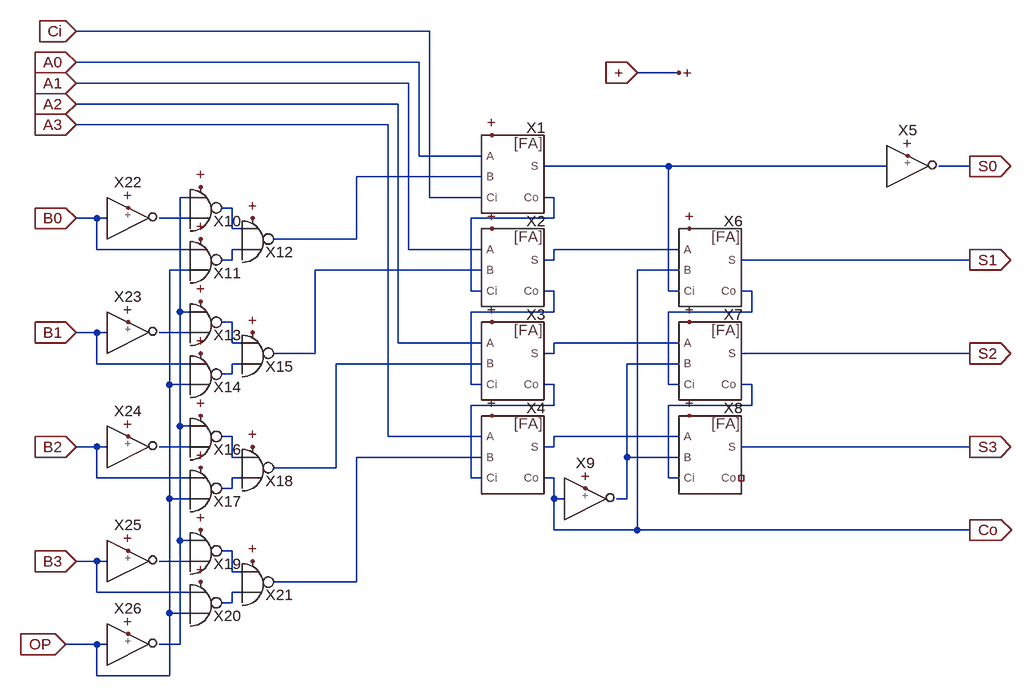
[diagram p0: schematic AddSub.asc]
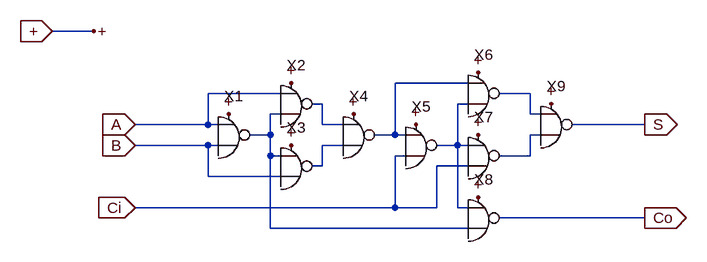
[diagram p1: sub-circuit fa.asc]
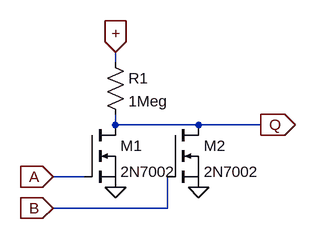
[diagram p2: sub-circuit nor2.asc]
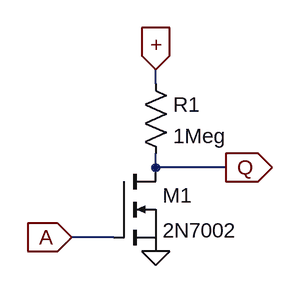
[diagram p3: sub-circuit inv.asc]
AddSub.asc, the LTspice schematic file:
Version 4
SHEET 1 1180 680
WIRE 272 -352 -272 -352
WIRE 256 -304 -272 -304
WIRE 656 -288 592 -288
WIRE 240 -272 -272 -272
WIRE 224 -240 -272 -240
WIRE 208 -208 -272 -208
WIRE 256 -160 256 -304
WIRE 352 -160 256 -160
WIRE 640 -144 448 -144
WIRE 976 -144 640 -144
WIRE 1104 -144 1056 -144
WIRE 352 -128 160 -128
WIRE -96 -96 -112 -96
WIRE 272 -96 272 -352
WIRE 352 -96 272 -96
WIRE 464 -96 448 -96
WIRE -32 -80 -48 -80
WIRE -240 -64 -272 -64
WIRE -224 -64 -240 -64
WIRE -96 -64 -144 -64
WIRE 464 -64 464 -96
WIRE 464 -64 336 -64
WIRE -32 -48 -32 -80
WIRE -16 -48 -32 -48
WIRE 160 -32 160 -128
WIRE 160 -32 32 -32
WIRE -240 -16 -240 -64
WIRE -96 -16 -240 -16
WIRE -16 -16 -32 -16
WIRE 240 -16 240 -272
WIRE 352 -16 240 -16
WIRE 656 -16 464 -16
WIRE -32 0 -32 -16
WIRE -32 0 -48 0
WIRE 464 0 464 -16
WIRE 464 0 448 0
WIRE 1104 0 752 0
WIRE -96 16 -128 16
WIRE 352 16 96 16
WIRE 656 16 592 16
WIRE 336 48 336 -64
WIRE 352 48 336 48
WIRE 464 48 448 48
WIRE 640 48 640 -144
WIRE 656 48 640 48
WIRE 768 48 752 48
WIRE -112 80 -112 -96
WIRE -96 80 -112 80
WIRE 464 80 464 48
WIRE 464 80 336 80
WIRE 768 80 768 48
WIRE 768 80 640 80
WIRE -32 96 -48 96
WIRE -240 112 -272 112
WIRE -224 112 -240 112
WIRE -96 112 -144 112
WIRE -32 128 -32 96
WIRE -16 128 -32 128
WIRE 224 128 224 -240
WIRE 352 128 224 128
WIRE 656 128 464 128
WIRE 96 144 96 16
WIRE 96 144 32 144
WIRE 464 144 464 128
WIRE 464 144 448 144
WIRE 1104 144 752 144
WIRE -240 160 -240 112
WIRE -96 160 -240 160
WIRE -16 160 -32 160
WIRE 352 160 128 160
WIRE 656 160 576 160
WIRE -32 176 -32 160
WIRE -32 176 -48 176
WIRE -128 192 -128 16
WIRE -96 192 -128 192
WIRE 336 192 336 80
WIRE 352 192 336 192
WIRE 464 192 448 192
WIRE 640 192 640 80
WIRE 656 192 640 192
WIRE 768 192 752 192
WIRE 464 224 464 192
WIRE 464 224 336 224
WIRE 768 224 768 192
WIRE 768 224 640 224
WIRE -112 256 -112 80
WIRE -96 256 -112 256
WIRE -32 272 -48 272
WIRE 208 272 208 -208
WIRE 352 272 208 272
WIRE 656 272 464 272
WIRE -240 288 -272 288
WIRE -224 288 -240 288
WIRE -96 288 -144 288
WIRE 464 288 464 272
WIRE 464 288 448 288
WIRE 1104 288 752 288
WIRE -32 304 -32 272
WIRE -16 304 -32 304
WIRE 352 304 160 304
WIRE 576 304 576 160
WIRE 656 304 576 304
WIRE 128 320 128 160
WIRE 128 320 32 320
WIRE -240 336 -240 288
WIRE -96 336 -240 336
WIRE -16 336 -32 336
WIRE 336 336 336 224
WIRE 352 336 336 336
WIRE 464 336 448 336
WIRE 640 336 640 224
WIRE 656 336 640 336
WIRE -32 352 -32 336
WIRE -32 352 -48 352
WIRE -128 368 -128 192
WIRE -96 368 -128 368
WIRE 464 368 464 336
WIRE 480 368 464 368
WIRE 576 368 576 304
WIRE 576 368 560 368
WIRE 464 416 464 368
WIRE 592 416 592 16
WIRE 592 416 464 416
WIRE 1104 416 592 416
WIRE -112 432 -112 256
WIRE -96 432 -112 432
WIRE -32 448 -48 448
WIRE -240 464 -272 464
WIRE -224 464 -240 464
WIRE -96 464 -144 464
WIRE -32 480 -32 448
WIRE -16 480 -32 480
WIRE 160 496 160 304
WIRE 160 496 32 496
WIRE -240 512 -240 464
WIRE -96 512 -240 512
WIRE -16 512 -32 512
WIRE -32 528 -32 512
WIRE -32 528 -48 528
WIRE -128 544 -128 368
WIRE -96 544 -128 544
WIRE -240 592 -288 592
WIRE -224 592 -240 592
WIRE -112 592 -112 432
WIRE -112 592 -144 592
WIRE -240 640 -240 592
WIRE -128 640 -128 544
WIRE -128 640 -240 640
FLAG 368 -192 +
FLAG 368 -48 +
FLAG 368 96 +
FLAG 368 240 +
FLAG 672 -48 +
FLAG 672 96 +
FLAG 672 240 +
FLAG 512 352 +
FLAG 1008 -160 +
FLAG -80 -112 +
FLAG -80 -32 +
FLAG 0 -64 +
FLAG -80 64 +
FLAG -80 144 +
FLAG 0 112 +
FLAG -80 240 +
FLAG -80 320 +
FLAG 0 288 +
FLAG -80 416 +
FLAG -80 496 +
FLAG 0 464 +
FLAG -192 -80 +
FLAG -192 96 +
FLAG -192 272 +
FLAG -192 448 +
FLAG -192 576 +
FLAG -288 592 OP
IOPIN -288 592 In
FLAG -272 -352 Ci
IOPIN -272 -352 In
FLAG -272 -304 A0
IOPIN -272 -304 In
FLAG -272 -272 A1
IOPIN -272 -272 In
FLAG -272 -240 A2
IOPIN -272 -240 In
FLAG -272 -208 A3
IOPIN -272 -208 In
FLAG -272 -64 B0
IOPIN -272 -64 In
FLAG -272 112 B1
IOPIN -272 112 In
FLAG -272 288 B2
IOPIN -272 288 In
FLAG -272 464 B3
IOPIN -272 464 In
FLAG 1104 -144 S0
IOPIN 1104 -144 Out
FLAG 1104 0 S1
IOPIN 1104 0 Out
FLAG 1104 144 S2
IOPIN 1104 144 Out
FLAG 1104 288 S3
IOPIN 1104 288 Out
FLAG 1104 416 Co
IOPIN 1104 416 Out
FLAG 592 -288 +
IOPIN 592 -288 In
FLAG 656 -288 +
FLAG 656 -288 +
SYMBOL FA 400 -144 R0
SYMATTR InstName X1
SYMBOL FA 400 0 R0
SYMATTR InstName X2
SYMBOL FA 400 144 R0
SYMATTR InstName X3
SYMBOL FA 400 288 R0
SYMATTR InstName X4
SYMBOL INV 1008 -144 R0
SYMATTR InstName X5
SYMBOL FA 704 0 R0
SYMATTR InstName X6
SYMBOL FA 704 144 R0
SYMATTR InstName X7
SYMBOL FA 704 288 R0
SYMATTR InstName X8
SYMBOL INV 512 368 R0
SYMATTR InstName X9
SYMBOL NOR2 -64 -80 R0
SYMATTR InstName X10
SYMBOL NOR2 -64 0 R0
SYMATTR InstName X11
SYMBOL NOR2 16 -32 R0
SYMATTR InstName X12
SYMBOL NOR2 -64 96 R0
SYMATTR InstName X13
SYMBOL NOR2 -64 176 R0
SYMATTR InstName X14
SYMBOL NOR2 16 144 R0
SYMATTR InstName X15
SYMBOL NOR2 -64 272 R0
SYMATTR InstName X16
SYMBOL NOR2 -64 352 R0
SYMATTR InstName X17
SYMBOL NOR2 16 320 R0
SYMATTR InstName X18
SYMBOL NOR2 -64 448 R0
SYMATTR InstName X19
SYMBOL NOR2 -64 528 R0
SYMATTR InstName X20
SYMBOL NOR2 16 496 R0
SYMATTR InstName X21
SYMBOL INV -192 -64 R0
SYMATTR InstName X22
SYMBOL INV -192 112 R0
SYMATTR InstName X23
SYMBOL INV -192 288 R0
SYMATTR InstName X24
SYMBOL INV -192 464 R0
SYMATTR InstName X25
SYMBOL INV -192 592 R0
SYMATTR InstName X26

fa.asc, the sub-circuit schematic file:
Version 4
SHEET 1 880 680
WIRE -128 -16 -192 -16
WIRE 448 64 336 64
WIRE 160 80 48 80
WIRE 544 80 496 80
WIRE 224 96 208 96
WIRE 448 96 432 96
WIRE 160 112 144 112
WIRE 544 112 544 80
WIRE 560 112 544 112
WIRE 48 128 48 80
WIRE 48 128 -64 128
WIRE 64 128 48 128
WIRE 224 128 224 96
WIRE 256 128 224 128
WIRE 720 128 608 128
WIRE 144 144 144 112
WIRE 144 144 112 144
WIRE 336 144 336 64
WIRE 336 144 304 144
WIRE 352 144 336 144
WIRE 560 144 544 144
WIRE 48 160 -64 160
WIRE 64 160 48 160
WIRE 256 160 224 160
WIRE 432 160 432 96
WIRE 432 160 400 160
WIRE 448 160 432 160
WIRE 144 176 144 144
WIRE 160 176 144 176
WIRE 352 176 336 176
WIRE 544 176 544 144
WIRE 544 176 496 176
WIRE 224 192 224 160
WIRE 224 192 208 192
WIRE 448 192 400 192
WIRE 48 208 48 160
WIRE 160 208 48 208
WIRE 336 256 336 176
WIRE 336 256 -64 256
WIRE 400 256 400 192
WIRE 400 256 336 256
WIRE 432 256 432 160
WIRE 448 256 432 256
WIRE 720 272 496 272
WIRE 144 288 144 176
WIRE 448 288 144 288
FLAG 80 112 +
FLAG 176 160 +
FLAG 176 64 +
FLAG 272 112 +
FLAG 464 48 +
FLAG 464 144 +
FLAG 464 240 +
FLAG 576 96 +
FLAG 368 128 +
FLAG -192 -16 +
IOPIN -192 -16 In
FLAG -128 -16 +
FLAG -64 128 A
IOPIN -64 128 In
FLAG -64 160 B
IOPIN -64 160 In
FLAG -64 256 Ci
IOPIN -64 256 In
FLAG 720 272 Co
IOPIN 720 272 Out
FLAG 720 128 S
IOPIN 720 128 Out
SYMBOL NOR2 96 144 R0
WINDOW 0 -8 -44 Bottom 2
SYMATTR InstName X1
SYMBOL NOR2 192 192 R0
WINDOW 0 -8 -44 Bottom 2
SYMATTR InstName X3
SYMBOL NOR2 288 144 R0
WINDOW 0 -8 -44 Bottom 2
SYMATTR InstName X4
SYMBOL NOR2 480 80 R0
WINDOW 0 -8 -44 Bottom 2
SYMATTR InstName X6
SYMBOL NOR2 480 176 R0
WINDOW 0 -8 -44 Bottom 2
SYMATTR InstName X7
SYMBOL NOR2 480 272 R0
WINDOW 0 -8 -44 Bottom 2
SYMATTR InstName X8
SYMBOL NOR2 592 128 R0
WINDOW 0 -8 -44 Bottom 2
SYMATTR InstName X9
SYMBOL NOR2 192 96 R0
WINDOW 0 -8 -44 Bottom 2
SYMATTR InstName X2
SYMBOL NOR2 384 160 R0
WINDOW 0 -8 -44 Bottom 2
SYMATTR InstName X5

nor2.asc, the sub-circuit schematic file:
Version 4
SHEET 1 880 680
WIRE 272 144 272 128
WIRE 272 240 272 224
WIRE 400 240 272 240
WIRE 496 240 400 240
WIRE 224 320 176 320
WIRE 352 368 352 320
WIRE 352 368 176 368
FLAG 272 336 0
FLAG 176 320 A
IOPIN 176 320 In
FLAG 496 240 Q
IOPIN 496 240 Out
FLAG 272 128 +
IOPIN 272 128 In
FLAG 400 336 0
FLAG 176 368 B
IOPIN 176 368 In
SYMBOL nmos 224 240 R0
SYMATTR InstName M1
SYMATTR Value 2N7002
SYMBOL res 256 128 R0
SYMATTR InstName R1
SYMATTR Value 1Meg
SYMBOL nmos 352 240 R0
SYMATTR InstName M2
SYMATTR Value 2N7002

inv.asc, the sub-circuit schematic file:
Version 4
SHEET 1 880 680
WIRE 272 144 272 128
WIRE 272 240 272 224
WIRE 352 240 272 240
WIRE 224 320 176 320
FLAG 272 336 0
FLAG 176 320 A
IOPIN 176 320 In
FLAG 352 240 Q
IOPIN 352 240 Out
FLAG 272 128 +
IOPIN 272 128 In
SYMBOL nmos 224 240 R0
SYMATTR InstName M1
SYMATTR Value 2N7002
SYMBOL res 256 128 R0
SYMATTR InstName R1
SYMATTR Value 1Meg

The netlist it stands for:
* AddSub.asc
XX1 + A0 N002 Ci N004 N001 fa
XX2 + A1 N009 N004 N010 N008 fa
XX3 + A2 N016 N010 N018 N014 fa
XX4 + A3 N023 N018 Co N021 fa
XX5 + N001 S0 inv
XX6 + N008 Co N001 N011 S1 fa
XX7 + N014 N017 N011 N019 S2 fa
XX8 + N021 N017 N019 NC_01 S3 fa
XX9 + Co N017 inv
XX10 + N003 N006 N005 nor2
XX11 + B0 OP N007 nor2
XX12 + N005 N007 N002 nor2
XX13 + N003 N013 N012 nor2
XX14 + B1 OP N015 nor2
XX15 + N012 N015 N009 nor2
XX16 + N003 N022 N020 nor2
XX17 + B2 OP N024 nor2
XX18 + N020 N024 N016 nor2
XX19 + N003 N026 N025 nor2
XX20 + B3 OP N027 nor2
XX21 + N025 N027 N023 nor2
XX22 + B0 N006 inv
XX23 + B1 N013 inv
XX24 + B2 N022 inv
XX25 + B3 N026 inv
XX26 + OP N003 inv

* block symbol definitions
.subckt fa + A B Ci Co S
XX1 + A B N005 nor2
XX3 + N005 B N007 nor2
XX4 + N003 N007 N001 nor2
XX6 + N001 N004 N002 nor2
XX7 + N004 Ci N006 nor2
XX8 + N004 N005 Co nor2
XX9 + N002 N006 S nor2
XX2 + A N005 N003 nor2
XX5 + N001 Ci N004 nor2
.ends fa

.subckt nor2 + A B Q
M1 Q A 0 0 2N7002
R1 + Q 1Meg
M2 Q B 0 0 2N7002
.ends nor2

.subckt inv + A Q
M1 Q A 0 0 2N7002
R1 + Q 1Meg
.ends inv

.model NMOS NMOS
.model PMOS PMOS
.lib standard.mos
.backanno
.end